# EAGLE design Atari_AV-Adapter (EAGLE 9.6.2)
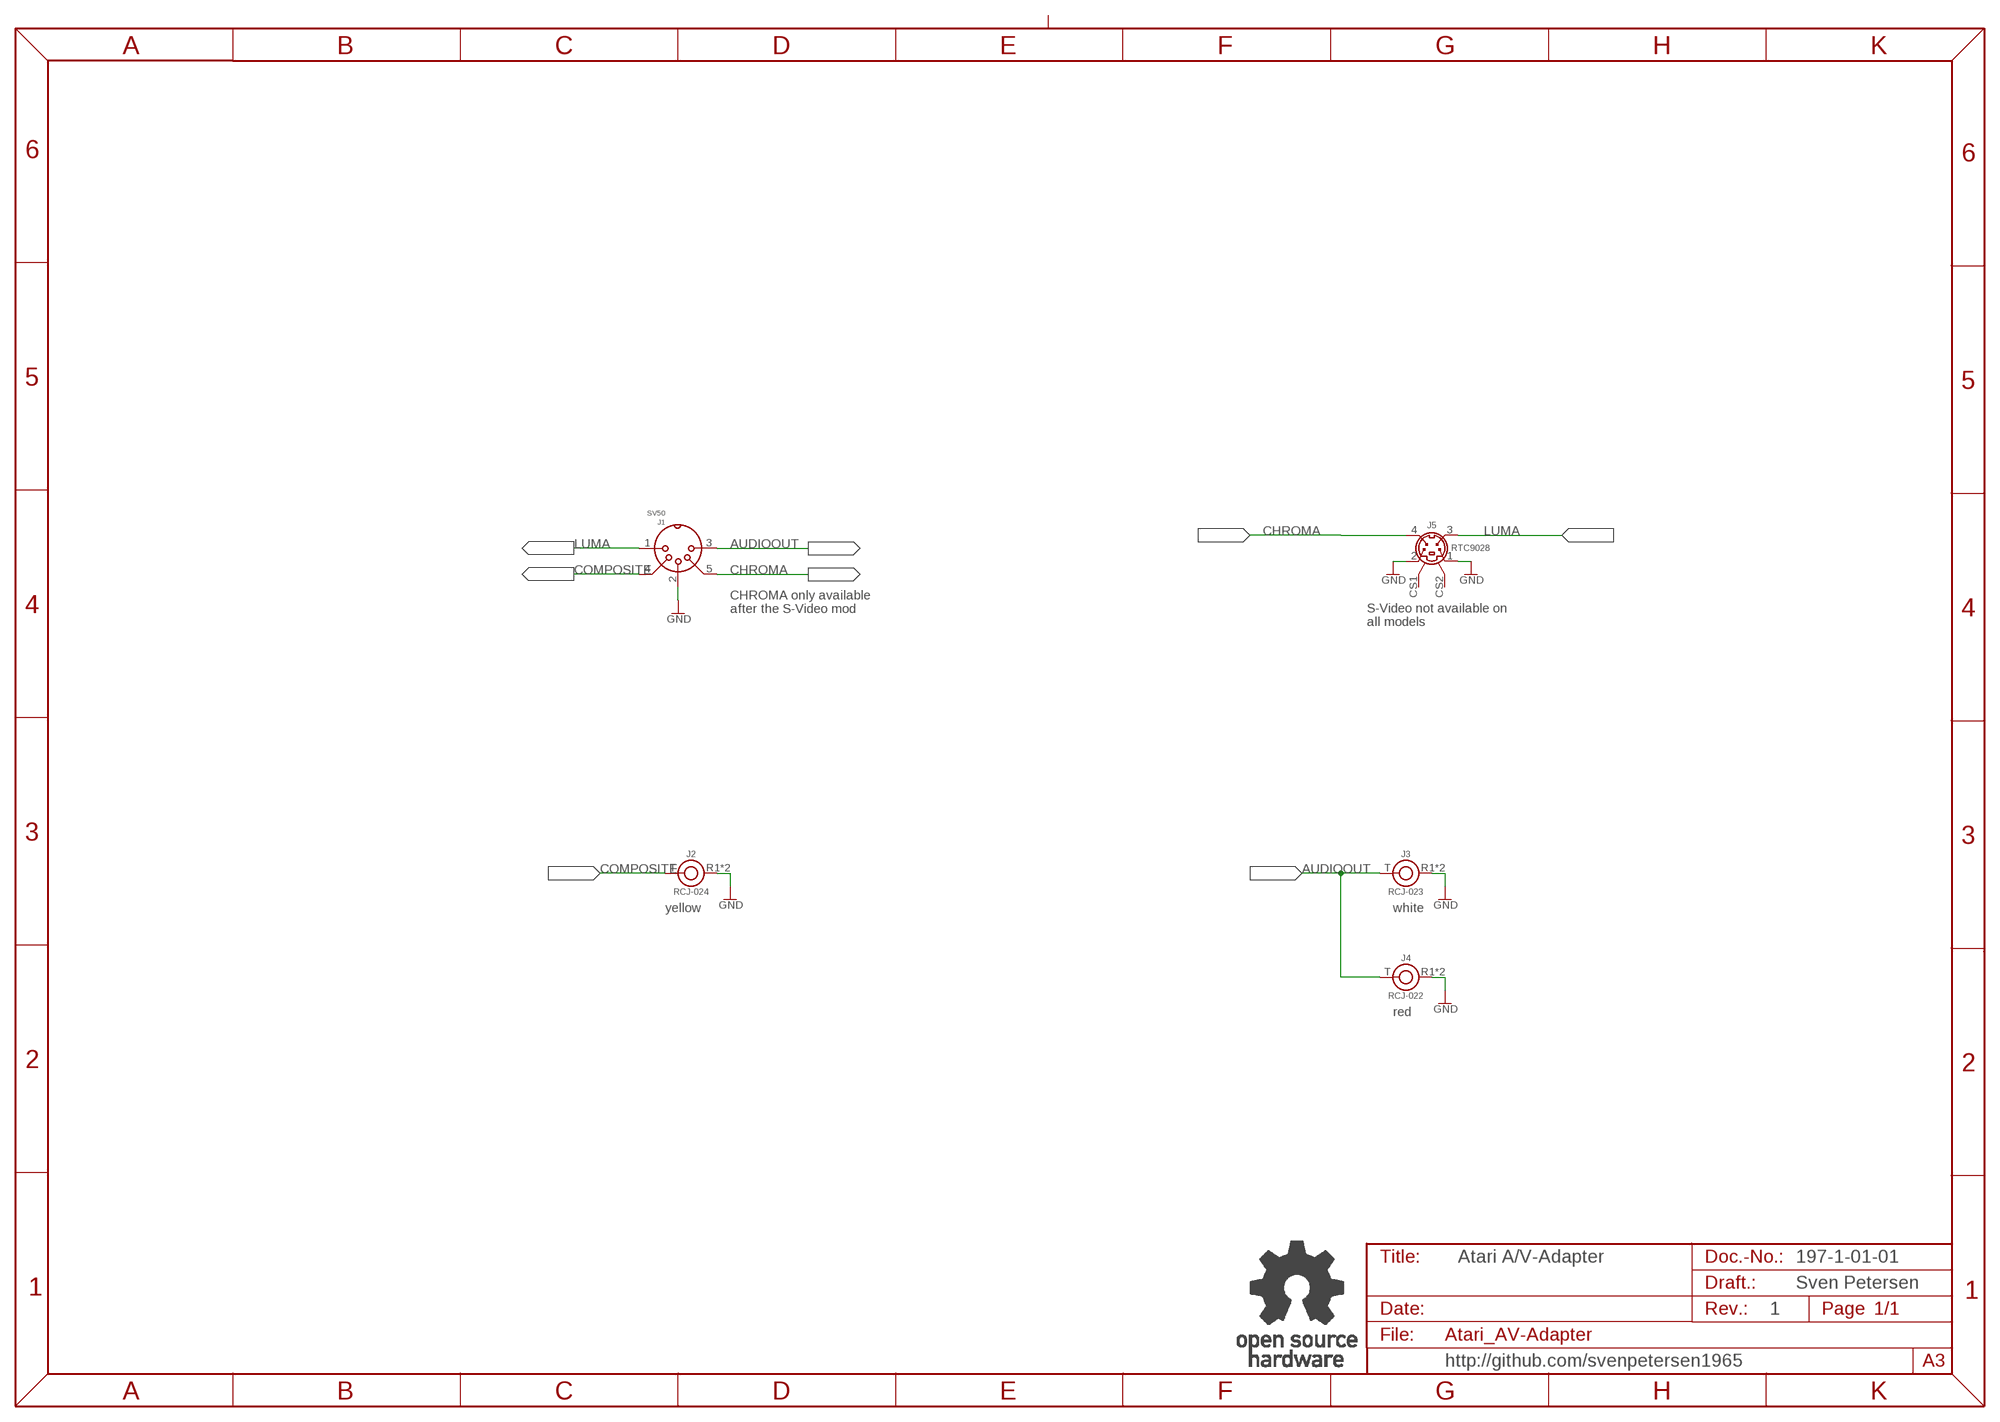
[diagram p0: schematic, sheet 1]

## Parts
J1  SV50  [SV50_INNER]
J2  RCJ-024  RCJ-02X  [RCJ-02X]
J3  RCJ-023  RCJ-02X  [RCJ-02X]
J4  RCJ-022  RCJ-02X  [RCJ-02X]
J5  RTC9028  [MINIDIN4_V]
U$25  OPEN_SOURCE_HW  [OPENHW]

## Nets
AUDIOOUT: J1.3 J3.T J4.T
CHROMA: J1.5 J5.4
COMPOSITE: J1.4 J2.T
GND: J1.2 J2.R1(R) J2.R2(R) J3.R1(R) J3.R2(R) J4.R1(R) J4.R2(R) J5.1 J5.2
LUMA: J1.1 J5.3
Unconnected: J5.CS1 J5.CS2

## Notes on the sheet
- CHROMA only available
  after the S-Video mod
- S-Video not available on 
  all models
- yellow | white
- red
- Atari A/V-Adapter | 197-1-01-01
- Sven Petersen
- 1
- http://github.com/svenpetersen1965

## Library data of the parts
J1 = Lumberg:SV50
J2-J4 = CUI_INC:RCJ-02X
J5 = RTConnector:RTC9028: Mini-DIN, 4p, vertical
U$25 = Logo:OPEN_SOURCE_HW

## Board
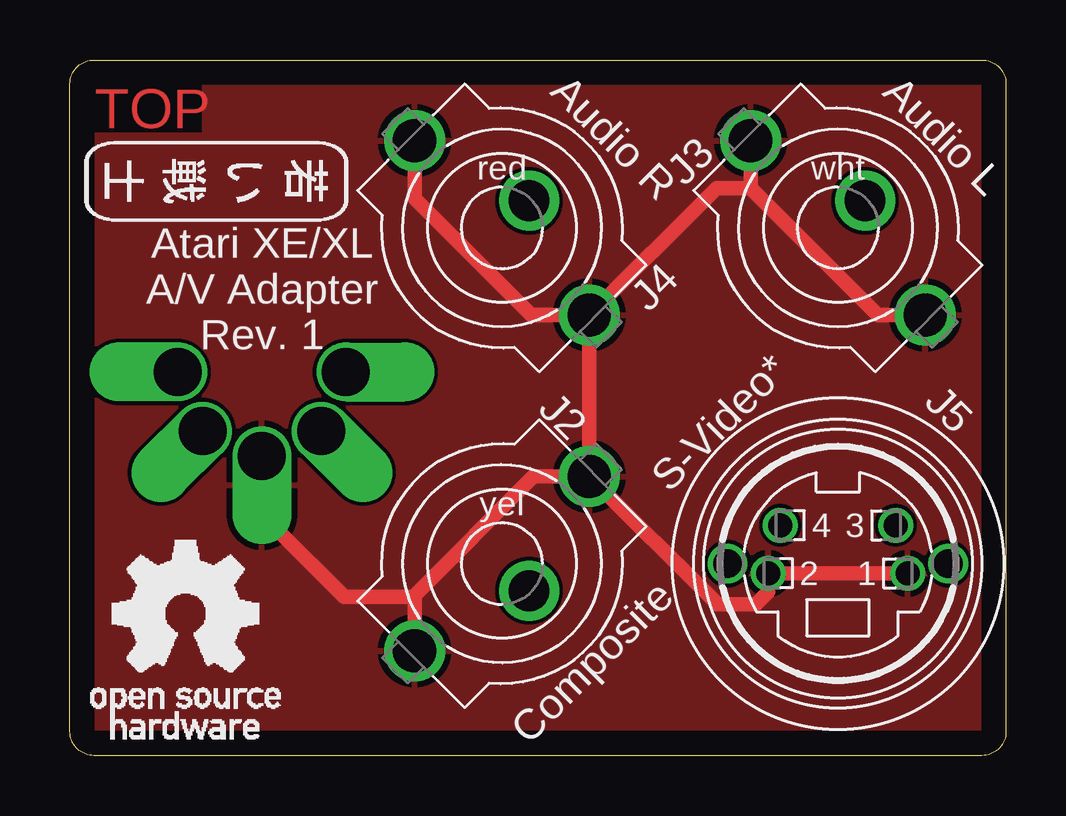
[diagram p1: board, top side]
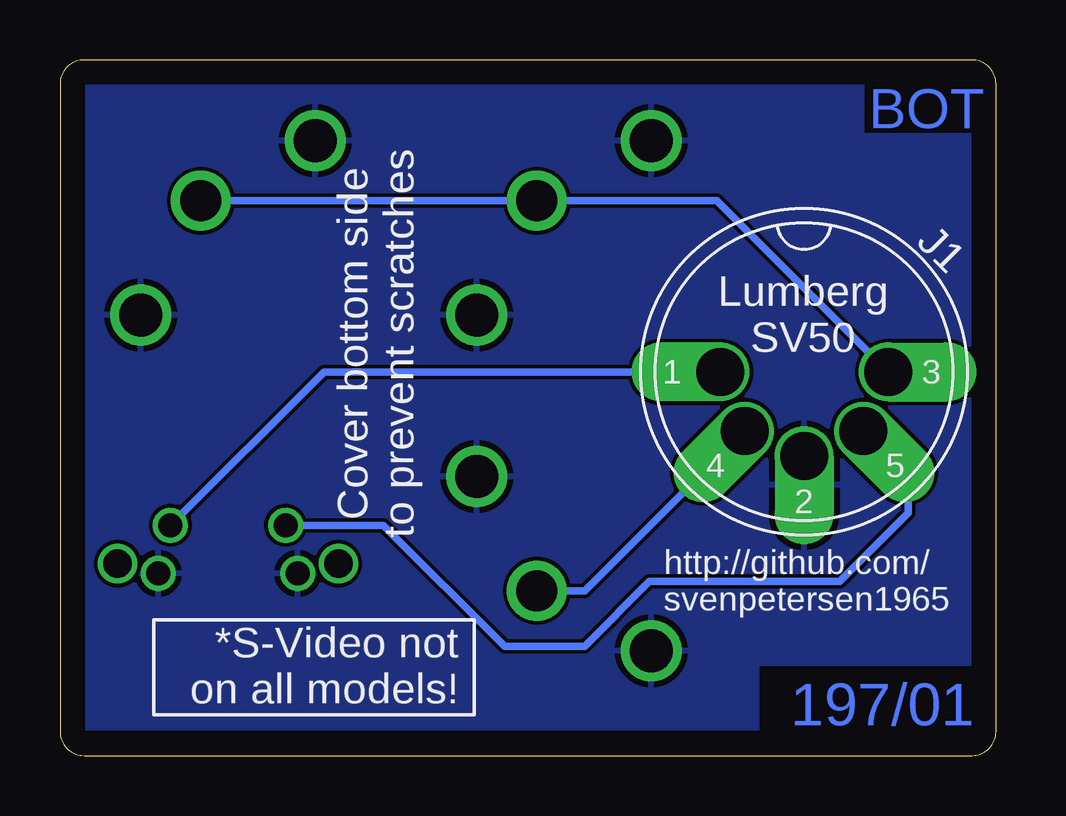
[diagram p2: board, bottom side, seen from below]

Size 39 x 29 mm. Coordinates in mm from the lower left corner, seen from the top.
Outline: 1,29 38,29 arc-90 39,28 39,1 arc-90 38,0 1,0 arc-90 0,1 0,28 arc-90 1,29
Copper layers (1*16): Top 0.035mm / dielectric 1.5mm / Bottom 0.035mm
Design rules "default *": minimum track width 6mil, minimum drill 0.35mm, track to track 6mil, track to pad 6mil, pad to pad 6mil, via to via 6mil, smd to smd 6mil, copper to edge 40mil, drill to drill 6mil, minimum pad ring 9mil, minimum via ring 8mil, stop-mask expansion 4mil, vias tented up to drill 25mil, thermal gap 10mil
bRestrict: 2 lines

### Footprints (pad centres in the part's own frame; a part is rotated, then mirrored left to right if it is on the bottom)
SV50_INNER = drill 2 pad 2.413 offset: 1 3.5,0; 2 0,3.5; 3 -3.5,0; 4 2.47,2.47; 5 -2.47,2.47
RCJ-02X = drill 1.8 pad 2.54: R1 -5.15,0; R2 5.15,0 | drill 1.7 pad 2.5: T 0,1.6
MINIDIN4_V = drill 1: 1 2.9,-0.4; 2 -2.9,-0.4; 3 2.4,1.6; 4 -2.4,1.6 | drill 1.2: CS1 4.6,0; CS2 -4.6,0

### Placement (x,y rotation side)
J1  8,16 180 bottom
J2  18,8 225 top
J3  32,22 315 top
J4  18,22 315 top
J5  32,8 0 top
U$22  [2LAYER]  1.02,26.15 0 top
U$23  [SVEN_TAG]  6.21,23.9 270 top
U$24  [PCB-TITLE/]  0.16,35.11 0 top  (outside the outline)
U$25  0.88,0.7 0 top

### Tracks (layer width: path | path; a pad name or v marks a point on that pad's centre or on a via)
AUDIOOUT
  Bottom 0.305: J1.3 11.63,23.13 J4.T J3.T
CHROMA
  Bottom 0.305: J5.4 25.53,9.6 20.48,4.55 17.14,4.55 14.45,7.25 6.51,7.25 3.65,10.11 3.65,11.65 J1.5
COMPOSITE
  Bottom 0.305: J2.T 17.13,6.87 J1.4
GND
  Top 0.61: J3.R2 33.66,18.36 28.36,23.66 | 28.36,23.66 J3.R1 | J4.R2 26.94,23.66 28.36,23.66 | J4.R1 14.36,23.21 19.21,18.36 J4.R2 | J4.R2 J2.R1 | J2.R1 19.31,11.64 14.36,6.69 | 14.36,6.69 J2.R2 | J1.2 8,10.05 11.43,6.62 14.29,6.62 14.36,6.69 | J5.1 J5.2 29.1,6.82 28.57,6.3 26.98,6.3 J2.R1
  pour Bottom: 0.79,28.05 38.05,28.05 38.05,1.16 0.79,1.16
  pour Top: 0.79,28.05 0.79,1.16 38.05,1.16 38.05,28.05
LUMA
  Bottom 0.305: J5.3 28,16 J1.1

### Text on the board
Bottom: 197/01
tPlace: Audio R | Audio L | red | wht | Atari XE/XL / A/V Adapter / Rev. 1 | S-Video* | yel | Composite
bPlace: Lumberg / SV50 | Cover bottom side / to prevent scratches | http://github.com/ / svenpetersen1965 | *S-Video not / on all models!
Measures: DIN / Plug
Document: Sven Petersen | 197-2-01-01 | 2022 | 35µm | 2 | 1